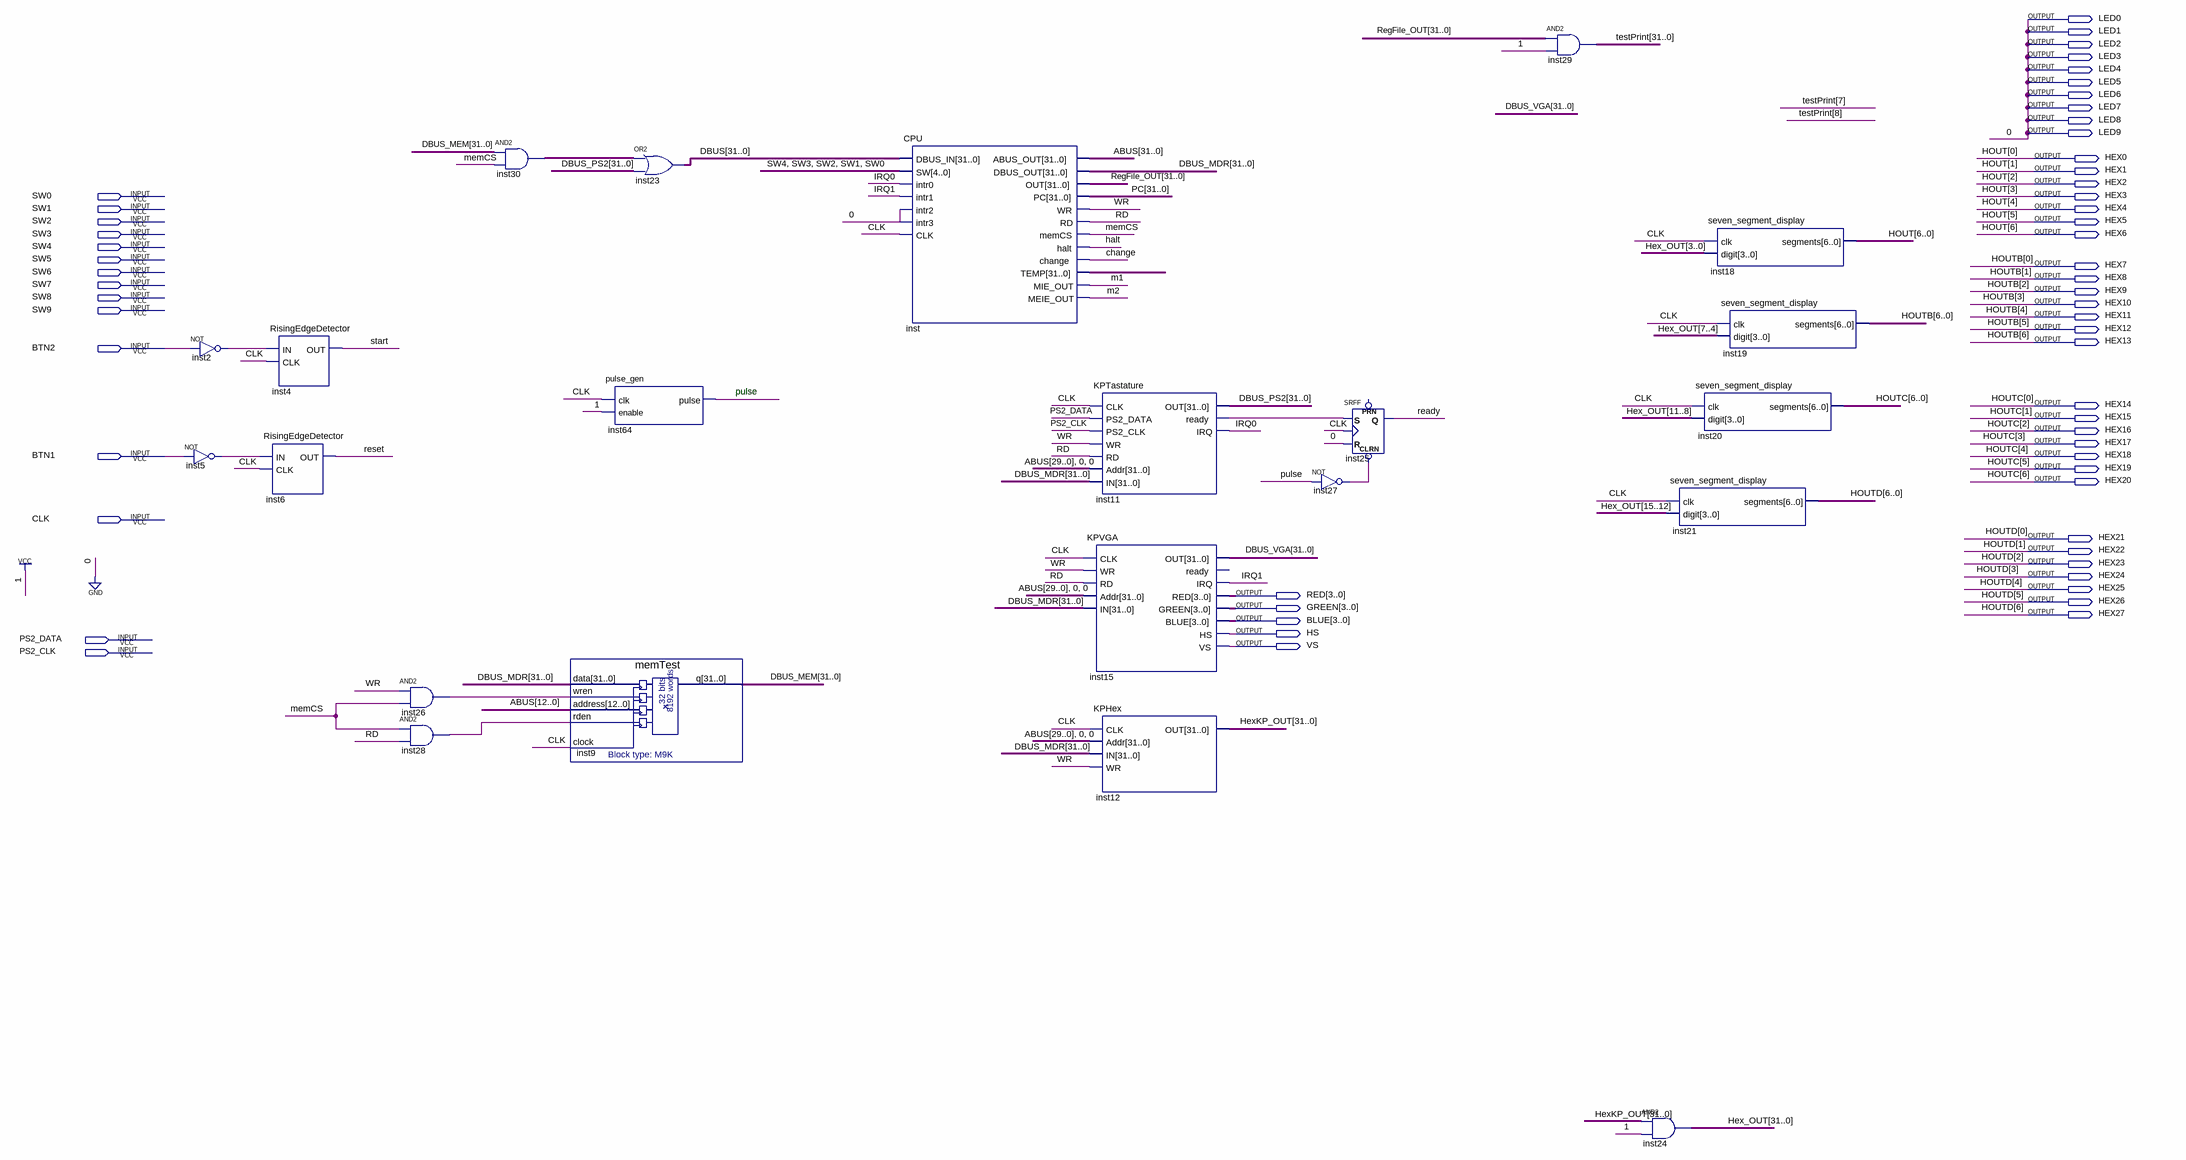
[diagram p0: schematic sheet]
// Quartus schematic Testiranje.bdf as structural Verilog: 22 symbols, 58 pins
module Testiranje (
  input  SW0,
  input  SW1,
  input  SW2,
  input  SW3,
  input  SW4,
  input  SW5,
  input  SW6,
  input  SW7,
  input  SW8,
  input  SW9,
  input  BTN2,
  input  BTN1,
  input  CLK,
  input  PS2_DATA,
  input  PS2_CLK,
  output LED0,
  output LED1,
  output LED2,
  output LED3,
  output LED4,
  output LED5,
  output LED6,
  output LED7,
  output LED8,
  output LED9,
  output HEX0,
  output HEX1,
  output HEX2,
  output HEX3,
  output HEX4,
  output HEX5,
  output HEX6,
  output HEX7,
  output HEX8,
  output HEX9,
  output HEX10,
  output HEX11,
  output HEX12,
  output HEX13,
  output HEX14,
  output HEX15,
  output HEX16,
  output HEX17,
  output HEX18,
  output HEX19,
  output HEX20,
  output HEX21,
  output HEX22,
  output HEX23,
  output HEX24,
  output HEX25,
  output [3:0] RED,
  output HEX26,
  output [3:0] GREEN,
  output HEX27,
  output [3:0] BLUE,
  output HS,
  output VS
);

  wire change, halt, inst2_out, inst5_out, inst11_ready, inst26_out, inst27_out, inst28_out, IRQ0, IRQ1, m1,
       m2, memCS, pulse, RD, ready, reset, start, WR;
  wire [31:0] ABUS, DBUS, DBUS_MDR, DBUS_MEM, DBUS_PS2, DBUS_VGA, Hex_OUT, HexKP_OUT, inst30_out, inst_temp,
       PC, RegFile_OUT, testPrint;

  not inst2 (inst2_out, BTN2);
  not inst5 (inst5_out, BTN1);
  RisingEdgeDetector inst4 (.IN(inst2_out), .CLK(CLK), .OUT(start));
  RisingEdgeDetector inst6 (.IN(inst5_out), .CLK(CLK), .OUT(reset));
  and inst26 (inst26_out, WR, memCS);
  and inst28 (inst28_out, memCS, RD);
  assign inst30_out = DBUS_MEM & {32{memCS}};  // AND2 inst30, 32 bits wide
  memTest inst9 (
    .data(DBUS_MDR), .wren(inst26_out), .address(ABUS[12:0]), .rden(inst28_out), .clock(CLK), .q(DBUS_MEM));
  assign DBUS = inst30_out | DBUS_PS2;  // OR2 inst23, 32 bits wide
  pulse_gen inst64 (.clk(CLK), .enable(1'b1), .pulse(pulse));
  CPU inst (
    .DBUS_IN(DBUS), .SW({SW4, SW3, SW2, SW1, SW0}), .intr0(IRQ0), .intr1(IRQ1), .intr2(1'b0), .intr3(1'b0),
    .CLK(CLK), .ABUS_OUT(ABUS), .DBUS_OUT(DBUS_MDR), .OUT(RegFile_OUT), .PC(PC), .WR(WR), .RD(RD),
    .memCS(memCS), .halt(halt), .change(change), .TEMP(inst_temp), .MIE_OUT(m1), .MEIE_OUT(m2));
  KPTastature inst11 (
    .CLK(CLK), .PS2_DATA(PS2_DATA), .PS2_CLK(PS2_CLK), .WR(WR), .RD(RD), .Addr({ABUS[29:0], 2'b00}),
    .IN(DBUS_MDR), .OUT(DBUS_PS2), .ready(inst11_ready), .IRQ(IRQ0));
  KPVGA inst15 (
    .CLK(CLK), .WR(WR), .RD(RD), .Addr({ABUS[29:0], 2'b00}), .IN(DBUS_MDR), .OUT(DBUS_VGA), .IRQ(IRQ1),
    .RED(RED), .GREEN(GREEN), .BLUE(BLUE), .HS(HS), .VS(VS));  // open: ready
  KPHex inst12 (.CLK(CLK), .Addr({ABUS[29:0], 2'b00}), .IN(DBUS_MDR), .WR(WR), .OUT(HexKP_OUT));
  SRFF inst25 (.CLRN(inst27_out), .S(inst11_ready), .R(1'b0), .CLK(CLK), .Q(ready));  // open: PRN
  not inst27 (inst27_out, pulse);
  assign testPrint = RegFile_OUT & {32{1'b1}};  // AND2 inst29, 32 bits wide
  assign Hex_OUT = HexKP_OUT & {32{1'b1}};  // AND2 inst24, 32 bits wide
  seven_segment_display inst18 (.clk(CLK), .digit(Hex_OUT[3:0]), .segments({HEX6, HEX5, HEX4, HEX3, HEX2, HEX1, HEX0}));
  seven_segment_display inst20 (
    .clk(CLK), .digit(Hex_OUT[11:8]), .segments({HEX20, HEX19, HEX18, HEX17, HEX16, HEX15, HEX14}));
  seven_segment_display inst21 (
    .clk(CLK), .digit(Hex_OUT[15:12]), .segments({HEX27, HEX26, HEX25, HEX24, HEX23, HEX22, HEX21}));
  seven_segment_display inst19 (
    .clk(CLK), .digit(Hex_OUT[7:4]), .segments({HEX13, HEX12, HEX11, HEX10, HEX9, HEX8, HEX7}));

  assign LED0 = 1'b0;
  assign LED1 = 1'b0;
  assign LED2 = 1'b0;
  assign LED3 = 1'b0;
  assign LED4 = 1'b0;
  assign LED5 = 1'b0;
  assign LED6 = 1'b0;
  assign LED7 = 1'b0;
  assign LED8 = 1'b0;
  assign LED9 = 1'b0;

  // Other names for the same wires on the sheet: HOUT[6:0] = {HEX6, HEX5, HEX4, HEX3, HEX2, HEX1, HEX0};
  //   HOUTB[6:0] = {HEX13, HEX12, HEX11, HEX10, HEX9, HEX8, HEX7};
  //   HOUTC[6:0] = {HEX20, HEX19, HEX18, HEX17, HEX16, HEX15, HEX14};
  //   HOUTD[6:0] = {HEX27, HEX26, HEX25, HEX24, HEX23, HEX22, HEX21}

  // Notes on the sheet:
  //   pulse
endmodule
